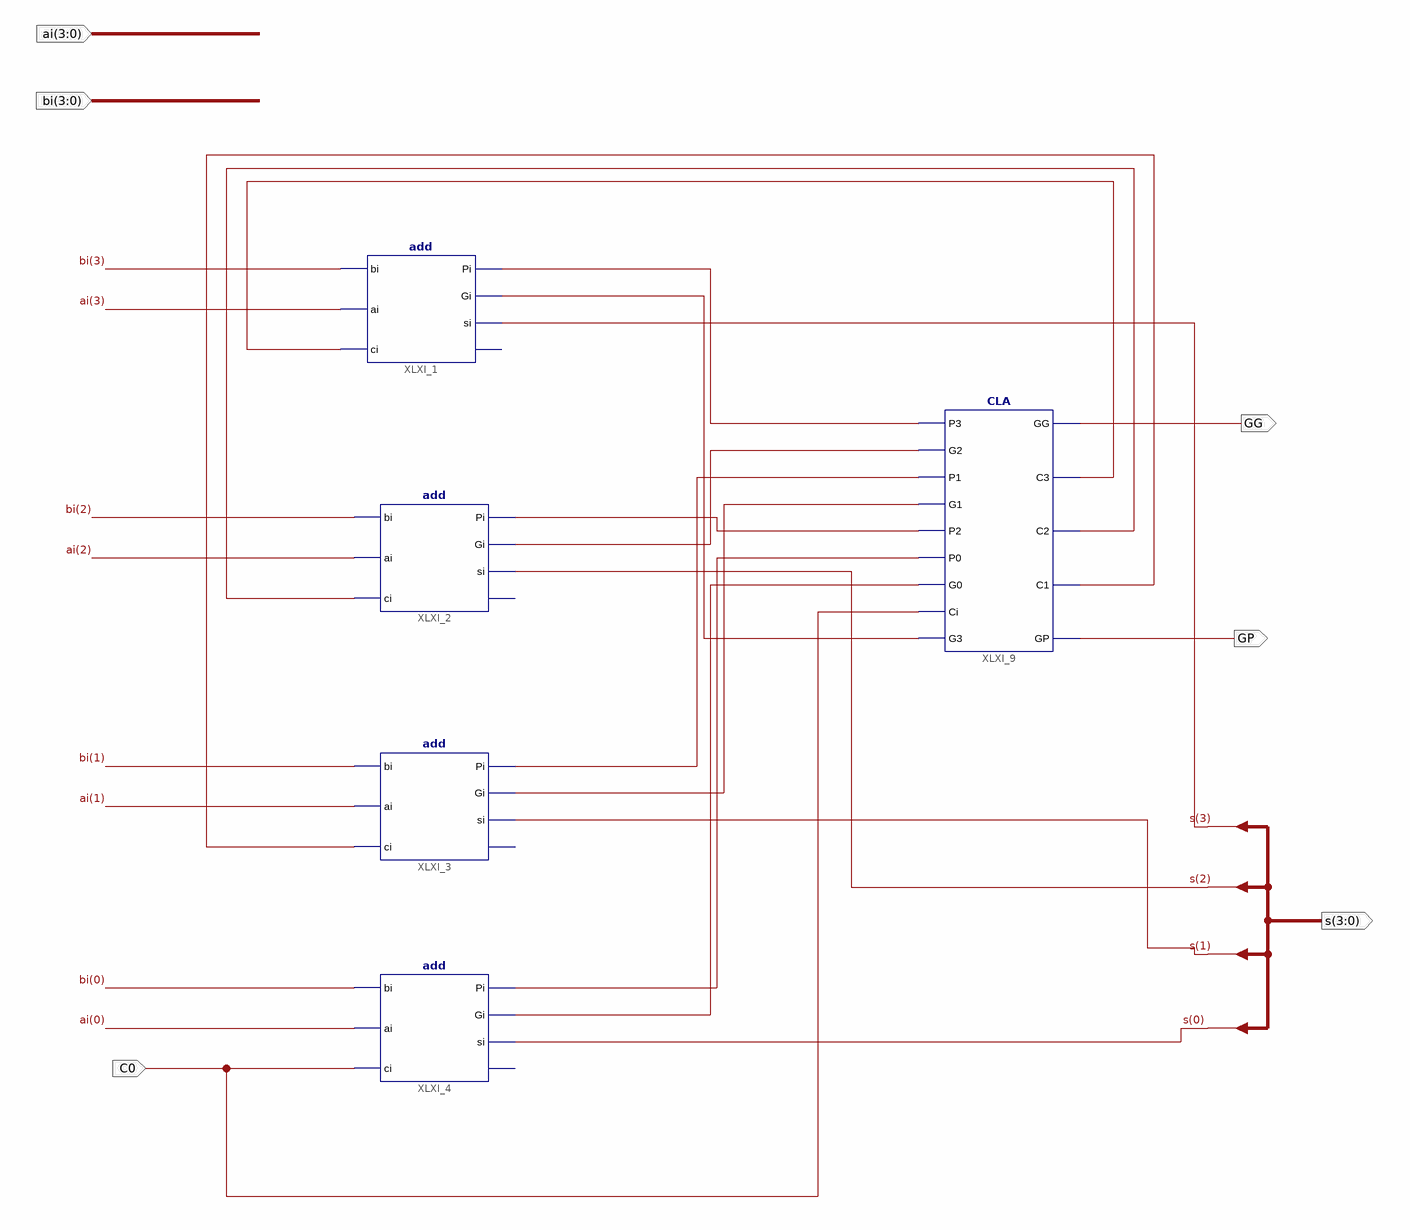
[diagram p0: schematic sheet 1]
// Xilinx ISE schematic add4b.sch (kintex7) as structural Verilog: 5 symbols, 6 ports
module add4b (
  input  [3:0] ai,
  input  [3:0] bi,
  input  C0,
  output GG,
  output GP,
  output [3:0] s
);

  wire XLXN_19, XLXN_20, XLXN_21, XLXN_24, XLXN_25, XLXN_26, XLXN_27, XLXN_28, XLXN_29, XLXN_30, XLXN_31;

  add XLXI_1 (.bi(bi[3]), .ai(ai[3]), .ci(XLXN_21), .Pi(XLXN_24), .Gi(XLXN_25), .si(s[3]));  // open: co
  add XLXI_2 (.bi(bi[2]), .ai(ai[2]), .ci(XLXN_20), .Pi(XLXN_26), .Gi(XLXN_27), .si(s[2]));  // open: co
  add XLXI_3 (.bi(bi[1]), .ai(ai[1]), .ci(XLXN_19), .Pi(XLXN_28), .Gi(XLXN_29), .si(s[1]));  // open: co
  add XLXI_4 (.bi(bi[0]), .ai(ai[0]), .ci(C0), .Pi(XLXN_30), .Gi(XLXN_31), .si(s[0]));  // open: co
  CLA XLXI_9 (
    .P3(XLXN_24), .G2(XLXN_27), .P1(XLXN_28), .G1(XLXN_29), .P2(XLXN_26), .P0(XLXN_30), .G0(XLXN_31),
    .Ci(C0), .G3(XLXN_25), .GG(GG), .C3(XLXN_21), .C2(XLXN_20), .C1(XLXN_19), .GP(GP));
endmodule
